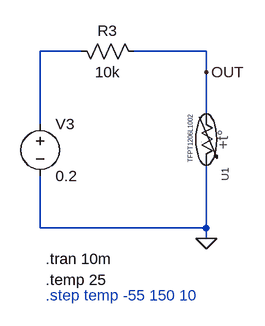
[diagram p0: schematic _TFPT_Vishay.asc]
_TFPT_Vishay.asc, the LTspice schematic file:
Version 4.1
SHEET 1 1848 836
WIRE -592 64 -656 64
WIRE -400 64 -512 64
WIRE -400 96 -400 64
WIRE -400 160 -400 96
WIRE -656 176 -656 64
WIRE -656 336 -656 256
WIRE -400 336 -400 240
WIRE -400 336 -656 336
WIRE -400 352 -400 336
FLAG -400 352 0
FLAG -400 96 OUT
SYMBOL res -608 48 M90
WINDOW 0 0 56 VBottom 2
WINDOW 3 32 56 VTop 2
SYMATTR InstName R3
SYMATTR Value 10k
SYMBOL voltage -656 160 R0
WINDOW 123 0 0 Left 2
WINDOW 39 0 0 Left 2
SYMATTR InstName V3
SYMATTR Value 0.2
SYMBOL MyLib\\Sensor_RTD\\_TFPT_Vishay -400 208 R90
SYMATTR InstName U1
TEXT -648 384 Left 2 !.tran 10m
TEXT -648 416 Left 2 !.temp 25
TEXT -648 440 Left 2 ;.step temp -55 150 10

The netlist it stands for:
* _TFPT_Vishay.asc
R3 N001 OUT 10k
V3 N001 0 0.2
X§U1 OUT 0 TFPT1206L1002 TOL25=0 TOLslope=0  ; pins RN RP
.tran 10m
.temp 25
* .step temp -55 150 10
.lib MyLib/Sensor_RTD/_TFPT_Vishay.lib
.backanno
.end